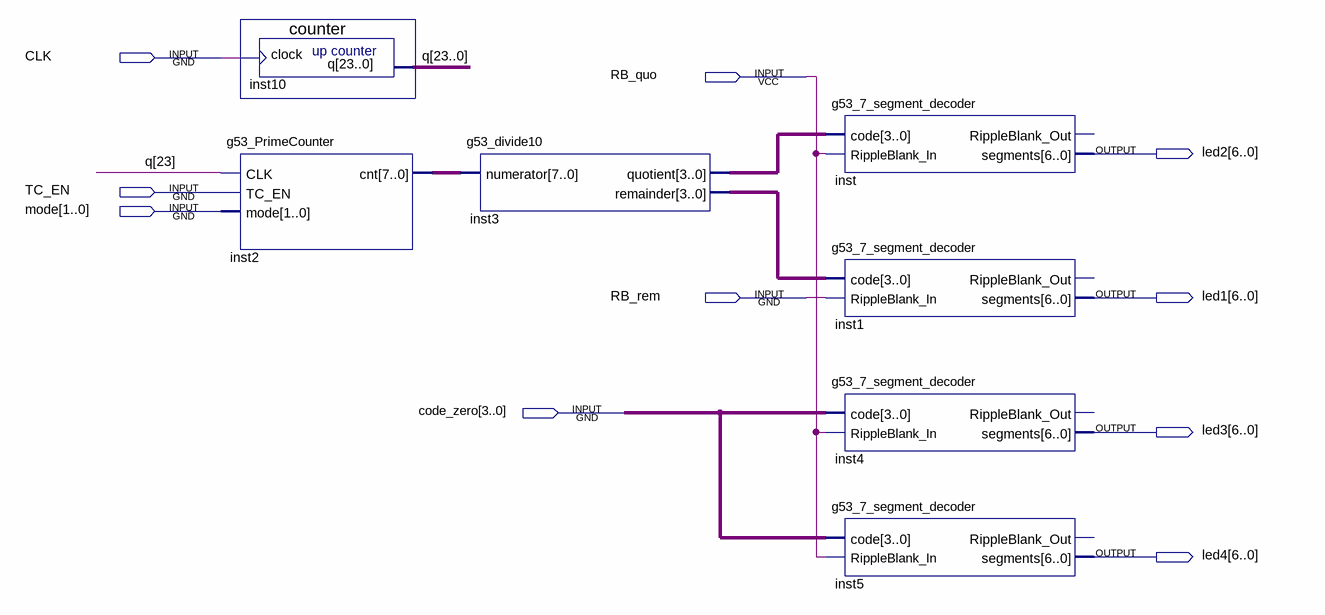
[diagram p0: schematic sheet]
// Quartus schematic g53_PrimeCounter_bench.bdf as structural Verilog: 7 symbols, 10 pins
module g53_PrimeCounter_bench (
  input  CLK,
  input  RB_quo,
  input  TC_EN,
  input  [1:0] mode,
  input  RB_rem,
  input  [3:0] code_zero,
  output [6:0] led2,
  output [6:0] led1,
  output [6:0] led3,
  output [6:0] led4
);

  wire [3:0] inst3_quotient, inst3_remainder;
  wire [7:0] inst2_cnt;
  wire [23:0] q;

  counter inst10 (.clock(CLK), .q(q));
  g53_PrimeCounter inst2 (.CLK(q[23]), .TC_EN(TC_EN), .mode(mode), .cnt(inst2_cnt));
  g53_divide10 inst3 (.numerator(inst2_cnt), .quotient(inst3_quotient), .remainder(inst3_remainder));
  g53_7_segment_decoder inst (
    .code(inst3_quotient), .RippleBlank_In(RB_quo), .segments(led2));  // open: RippleBlank_Out
  g53_7_segment_decoder inst1 (
    .code(inst3_remainder), .RippleBlank_In(RB_rem), .segments(led1));  // open: RippleBlank_Out
  g53_7_segment_decoder inst4 (.code(code_zero), .RippleBlank_In(RB_quo), .segments(led3));  // open: RippleBlank_Out
  g53_7_segment_decoder inst5 (.code(code_zero), .RippleBlank_In(RB_quo), .segments(led4));  // open: RippleBlank_Out
endmodule
